# EAGLE design USB-6002-breakout-AIO (EAGLE 9.3.0)
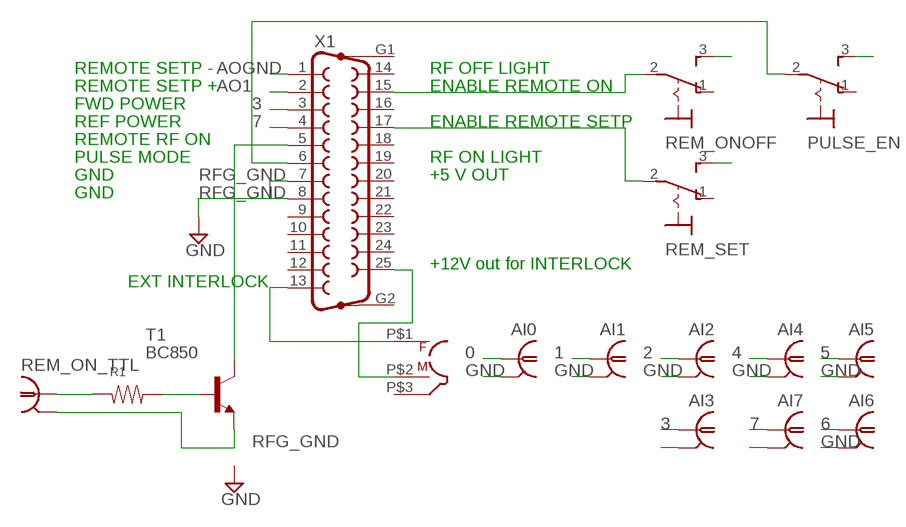
[diagram p0: schematic, sheet 1]

## Parts
AI0  BNC-V  [BNC-V]
AI1  BNC-V  [BNC-V]
AI2  BNC-V  [BNC-V]
AI3  BNC-V  [BNC-V]
AI4  BNC-V  [BNC-V]
AI5  BNC-V  [BNC-V]
AI6  BNC-V  [BNC-V]
AI7  BNC-V  [BNC-V]
INTERLOCK  TWINAX  [TWINAX-V]
PULSE_EN  M9040P  [M9040P]
R1  RES1206  [1206]
REM_ON_TTL  BNC-V  [BNC-V]
REM_ONOFF  M9040P  [M9040P]
REM_SET  M9040P  [M9040P]
T1  BC850  [SOT23]
X1  F25VP  [F25VP]

## Nets
0: AI0.1
1: AI1.1
2: AI2.1
3: AI3.1 X1.3
4: AI4.1
5: AI5.1
6: AI6.1
7: AI7.1 X1.4
AO1: X1.2
AOGND: X1.1
GND: AI0.2 AI1.2 AI2.2 AI3.2 AI4.2 AI5.2 AI6.2 AI7.2
N$1: REM_ONOFF.2(P) X1.15
N$2: REM_SET.2(P) X1.17
N$3: T1.3(C) X1.5
N$4: R1.1 REM_ON_TTL.1
N$5: R1.2 T1.1(B)
N$6: PULSE_EN.2(P) X1.6
N$7: INTERLOCK.P$1 X1.13
N$8: INTERLOCK.P$2 X1.25
RFG_GND: PULSE_EN.3(S) REM_ON_TTL.2 REM_ONOFF.3(S) REM_SET.3(S) T1.2(E) X1.7 X1.8 ; supply symbol labelled GND
Unconnected: INTERLOCK.P$3 PULSE_EN.1(O) REM_ONOFF.1(O) REM_SET.1(O) X1.9 X1.10 X1.11 X1.12 X1.14 X1.16 X1.18 X1.19 X1.20 X1.21 X1.22 X1.23 X1.24 X1.G1 X1.G2

## Notes on the sheet
- REMOTE SETP - | RF OFF LIGHT
- REMOTE SETP + | ENABLE REMOTE ON
- FWD POWER
- REF POWER | ENABLE REMOTE SETP
- REMOTE RF ON
- PULSE MODE | RF ON LIGHT
- GND | +5 V OUT
- GND
- +12V out for INTERLOCK
- EXT INTERLOCK

## Library data of the parts
AI0 AI1-AI7 REM_ON_TTL = connector-jqi:BNC: BNC Connector.
INTERLOCK = connector-jqi:TWINAX
PULSE_EN REM_ONOFF REM_SET = switch:M9040P: TOGGLE SWITCH Marquardt
R1 = rlc-jqi:RES: SMT Resistor
T1 = transistor:BC850: NPN TRANSISTOR
X1 = con-subd:F25VP: SUB-D; OC_FARNELL: unknown; OC_NEWARK: unknown

## Board
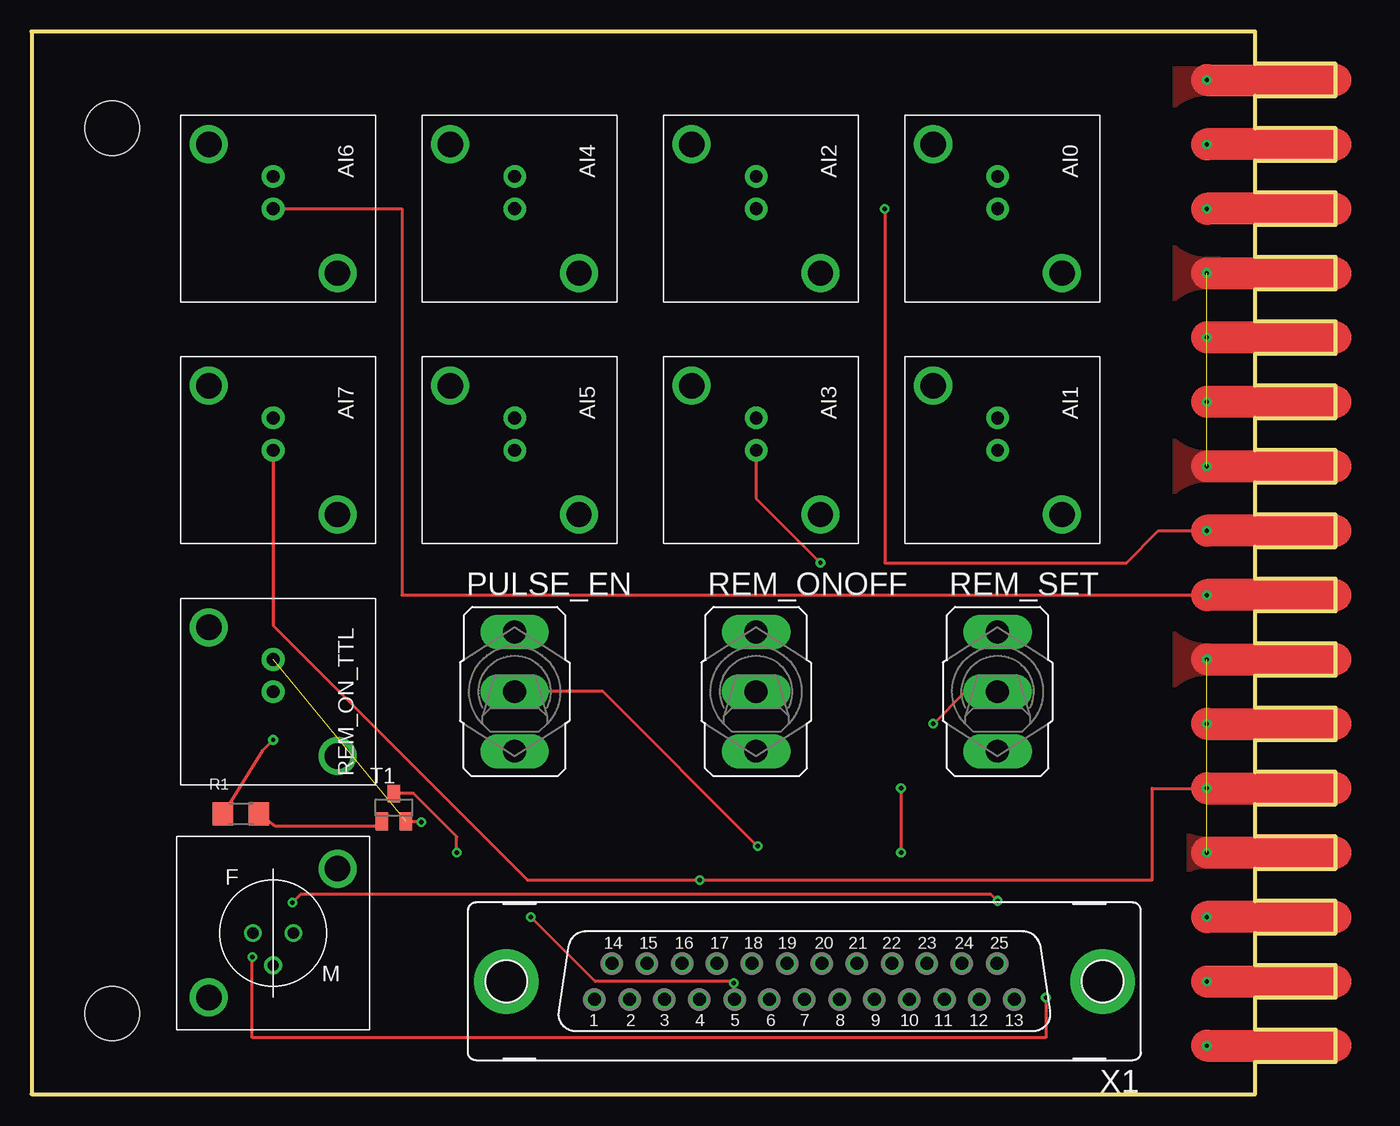
[diagram p1: board, top side]
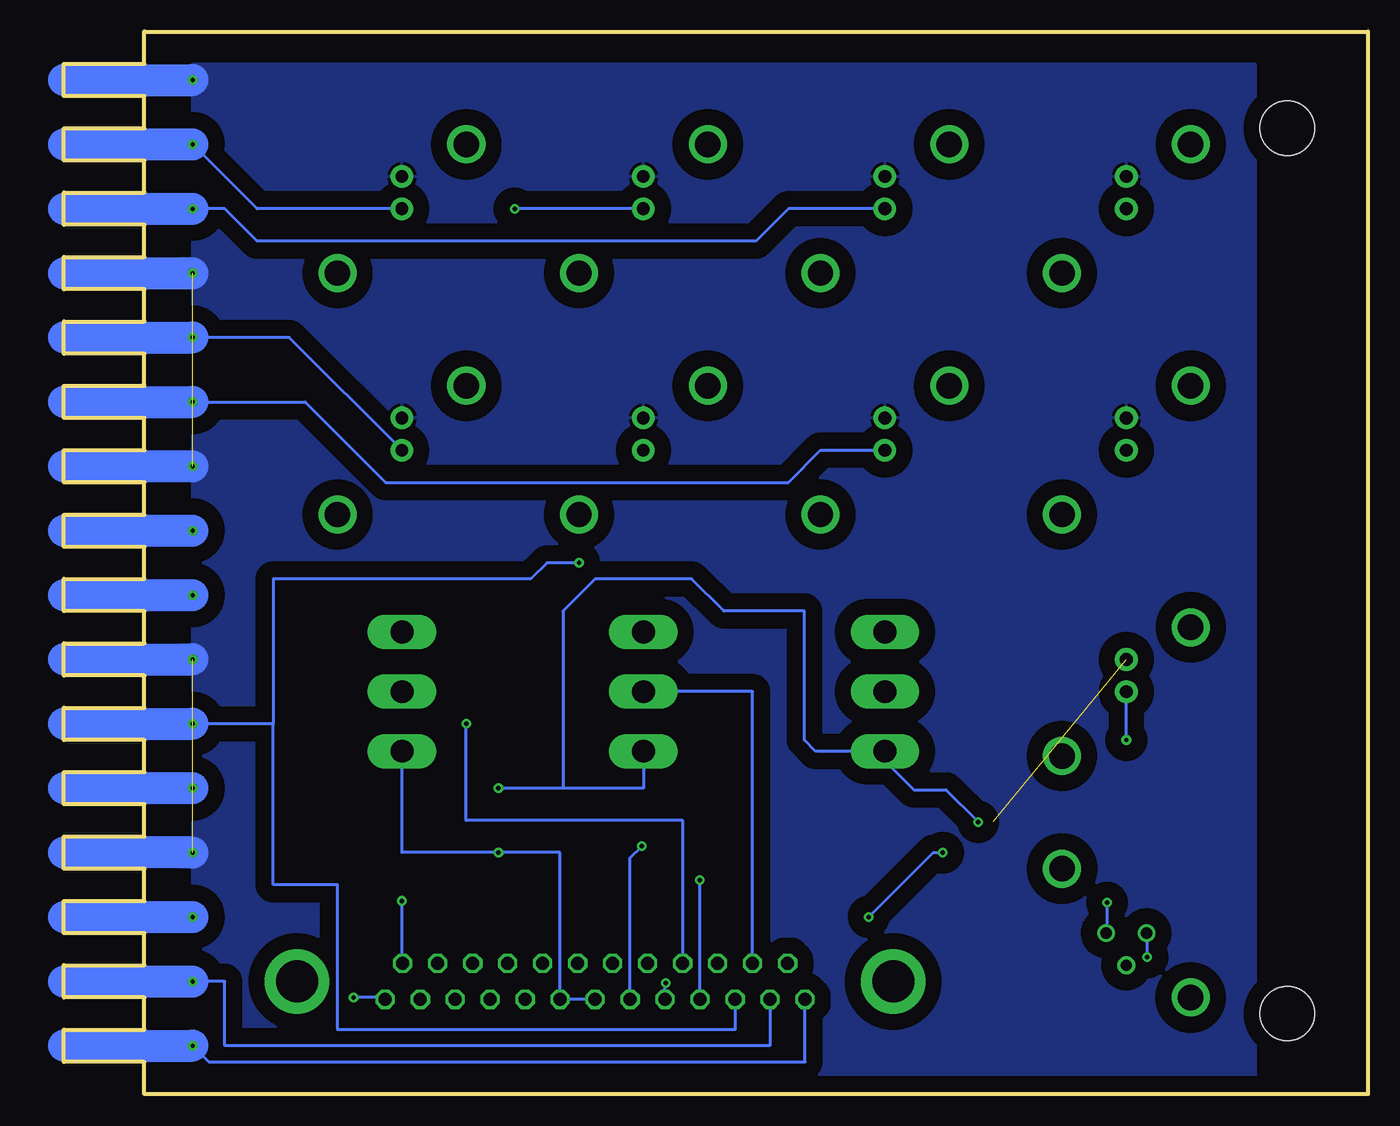
[diagram p2: board, bottom side, seen from below]

Size 102.87 x 83.82 mm. Coordinates in mm from the lower left corner, seen from the top.
Outline: 96.52,83.82 0,83.82 0,0 96.52,0 96.52,2.54 102.87,2.54 102.87,5.08 96.52,5.08 96.52,7.62 102.87,7.62 102.87,10.16 96.52,10.16 96.52,12.7 102.87,12.7 102.87,15.24 96.52,15.24 96.52,17.78 102.87,17.78 102.87,20.32 96.52,20.32 96.52,22.86 102.87,22.86 102.87,25.4 96.52,25.4 96.52,27.94 102.87,27.94 102.87,30.48 96.52,30.48 96.52,33.02 102.87,33.02 102.87,35.56 96.52,35.56 96.52,38.1 102.87,38.1 102.87,40.64 96.52,40.64 96.52,43.18 102.87,43.18 102.87,45.72 96.52,45.72 96.52,48.26 102.87,48.26 102.87,50.8 96.52,50.8 96.52,53.34 102.87,53.34 102.87,55.88 96.52,55.88 96.52,58.42 102.87,58.42 102.87,60.96 96.52,60.96 96.52,63.5 102.87,63.5 102.87,66.04 96.52,66.04 96.52,68.58 102.87,68.58 102.87,71.12 96.52,71.12 96.52,73.66 102.87,73.66 102.87,76.2 96.52,76.2 96.52,78.74 102.87,78.74 102.87,81.28 96.52,81.28 96.52,83.82
Copper layers (1*16): Top 0.035mm / dielectric 1.5mm / Bottom 0.035mm
Design rules "default": minimum track width 6mil, minimum drill 0.35mm, track to track 6mil, track to pad 6mil, pad to pad 6mil, via to via 6mil, smd to smd 6mil, copper to edge 40mil, drill to drill 6mil, minimum pad ring 10mil, minimum via ring 8mil, stop-mask expansion 4mil, vias tented up to drill 0mil, thermal gap 10mil
Holes 4.31 mm at 6.35,6.35 6.35,76.2

### Footprints (pad centres in the part's own frame; a part is rotated, then mirrored left to right if it is on the bottom)
BNC-V = drill 1 pad 1.778: 1 0,0; 2 -2.54,0 | drill 2 pad 2.032: ANCHOR1 -5.08,-5.08; ANCHOR2 5.08,5.08
TWINAX-V = drill 0.889: P$1 -1.6,0; P$2 1.6,0; P$3 0,-2.54 | drill 2.007: P$4 5.08,5.08; P$5 -5.08,-5.08
M9040P = drill 1.803 long: 1 0,4.699; 2 0,0; 3 0,-4.699
1206 = smd 1.6 x 1.803: 1 -1.422,0; 2 1.422,0
SOT23 = smd 1 x 1.4: 1 -0.95,-1.1; 2 0.95,-1.1; 3 0,1.1
F25VP = drill 1.016 octagon: 1 16.561,1.422; 2 13.792,1.422; 3 11.049,1.422; 4 8.28,1.422; 5 5.512,1.422; 6 2.769,1.422; 7 0,1.422; 8 -2.769,1.422; 9 -5.512,1.422; 10 -8.28,1.422; 11 -11.049,1.422; 12 -13.792,1.422; 13 -16.561,1.422; 14 15.189,-1.422; 15 12.421,-1.422; 16 9.652,-1.422; 17 6.909,-1.422; 18 4.14,-1.422; 19 1.372,-1.422; 20 -1.372,-1.422; 21 -4.14,-1.422; 22 -6.909,-1.422; 23 -9.652,-1.422; 24 -12.421,-1.422; 25 -15.189,-1.422 | drill 3.302 pad 5.08: G1 -23.52,0; G2 23.52,0

### Placement (x,y rotation side)
AI0  76.2,69.85 270 top
AI1  76.2,50.8 270 top
AI2  57.15,69.85 270 top
AI3  57.15,50.8 270 top
AI4  38.1,69.85 270 top
AI5  38.1,50.8 270 top
AI6  19.05,69.85 270 top
AI7  19.05,50.8 270 top
INTERLOCK  19.05,12.7 0 top
PULSE_EN  38.1,31.75 0 top
R1  16.51,22.1 0 top
REM_ON_TTL  19.05,31.75 270 top
REM_ONOFF  57.15,31.75 0 top
REM_SET  76.2,31.75 0 top
T1  28.57,22.61 0 top
X1  60.96,8.89 180 top

### Tracks (layer width: path | path; a pad name or v marks a point on that pad's centre or on a via)
0  (via drill 0.35)
  Top 2.54: 102.87,74.93 v92.71,74.93
  Bottom 0.254: AI0.1 87.63,69.85 v92.71,74.93
  Bottom 2.54: 102.87,74.93 v92.71,74.93
1  (via drill 0.35)
  Top 2.54: 102.87,59.69 v92.71,59.69
  Bottom 0.254: AI1.1 85.09,59.69 v92.71,59.69
  Bottom 2.54: 102.87,59.69 v92.71,59.69
2  (via drill 0.35)
  Top 0.254: v67.31,69.85 67.31,41.91 86.36,41.91 88.9,44.45 v92.71,44.45
  Top 2.54: 102.87,44.45 v92.71,44.45
  Bottom 0.254: AI2.1 v67.31,69.85
  Bottom 2.54: 102.87,44.45 v92.71,44.45
3  (via drill 0.35)
  Top 0.254: AI3.1 57.15,46.99 v62.23,41.91
  Top 2.54: v92.71,29.21 102.87,29.21
  Bottom 0.254: X1.3 49.91,5.08 81.28,5.08 81.28,16.51 86.36,16.51 86.36,29.21 | 86.36,29.21 v92.71,29.21 | v62.23,41.91 64.77,41.91 66.04,40.64 86.36,40.64 86.36,29.21
  Bottom 2.54: 102.87,29.21 v92.71,29.21
4  (via drill 0.35)
  Top 2.54: 102.87,69.85 v92.71,69.85
  Bottom 0.254: AI4.1 45.72,69.85 48.26,67.31 87.63,67.31 90.17,69.85 v92.71,69.85
  Bottom 2.54: 102.87,69.85 v92.71,69.85
5  (via drill 0.35)
  Top 2.54: 102.87,54.61 v92.71,54.61
  Bottom 0.254: v92.71,54.61 83.82,54.61 77.47,48.26 45.72,48.26 43.18,50.8 AI5.1
  Bottom 2.54: 102.87,54.61 v92.71,54.61
6  (via drill 0.35)
  Top 0.254: AI6.1 29.21,69.85 29.21,39.37 v92.71,39.37
  Top 2.54: 102.87,39.37 v92.71,39.37
  Bottom 2.54: 102.87,39.37 v92.71,39.37
7  (via drill 0.35)
  Top 0.254: v92.71,24.13 88.39,24.13 88.39,16.89 v52.7,16.89 39.12,16.89 19.05,36.96 AI7.1
  Top 2.54: v92.71,24.13 102.87,24.13
  Bottom 0.254: X1.4 52.68,16.89 v52.7,16.89
  Bottom 2.54: v92.71,24.13 102.87,24.13
AO0  (via drill 0.35)
  Top 2.54: 102.87,13.97 v92.71,13.97
  Bottom 2.54: 102.87,13.97 v92.71,13.97
AO1  (via drill 0.35)
  Top 2.54: v92.71,8.89 102.87,8.89
  Bottom 0.254: X1.2 47.17,3.81 90.17,3.81 90.17,8.89 v92.71,8.89
  Bottom 2.54: 102.87,8.89 v92.71,8.89
AOGND  (via drill 0.35)
  Top 2.54: v92.71,3.81 102.87,3.81
  Bottom 0.254: v92.71,3.81 91.44,2.54 44.4,2.54 X1.1
  Bottom 2.54: 102.87,3.81 v92.71,3.81
GND  (via drill 0.35)  (2 unrouted)
  Top 2.54: v92.71,80.01 102.87,80.01 | v92.71,64.77 102.87,64.77 | v92.71,49.53 102.87,49.53 | v92.71,34.29 102.87,34.29 | v92.71,19.05 102.87,19.05
  Bottom 2.54: 102.87,80.01 v92.71,80.01 | 102.87,64.77 v92.71,64.77 | 102.87,49.53 v92.71,49.53 | 102.87,34.29 v92.71,34.29 | v92.71,19.05 102.87,19.05
  pour Top (isolate 2.54): 96.52,82.55 96.52,1.27 90.17,1.27 90.17,82.55
  pour Bottom (isolate 2.54): 95.25,82.55 90.17,82.55 90.17,1.27 95.25,1.27
  pour Bottom (isolate 1.27): 92.71,81.28 8.89,81.28 8.89,1.27 92.71,1.27
N$1
  Bottom 0.254: X1.15 48.54,31.75 REM_ONOFF.2
N$2  (via drill 0.35)
  Top 0.254: REM_SET.2 73.66,31.75 v71.12,29.21
  Bottom 0.254: X1.17 54.05,21.59 71.12,21.59 v71.12,29.21
N$3  (via drill 0.35)
  Top 0.254: v55.37,8.76 55.37,8.89 44.45,8.89 v39.37,13.97 | v33.53,19.05 33.53,20.32 30.14,23.71 T1.3
  Bottom 0.254: X1.5 55.45,8.76 v55.37,8.76 | v39.37,13.97 34.29,19.05 v33.53,19.05
N$4  (via drill 0.35)
  Top 0.254: v19.05,27.94 18.21,27.1 R1.1
  Bottom 0.254: v19.05,27.94 REM_ON_TTL.1
N$5
  Top 0.254: T1.1 27.24,21.12 19.21,21.12 R1.2
N$6  (via drill 0.35)
  Top 0.254: v57.28,19.56 45.09,31.75 PULSE_EN.2
  Bottom 0.254: X1.6 58.19,18.64 v57.28,19.56
N$7  (via drill 0.35)
  Top 0.254: v80.01,7.62 80.01,4.45 17.4,4.45 v17.4,10.79
  Bottom 0.254: X1.13 77.67,7.62 v80.01,7.62 | v17.4,10.79 17.4,12.7 INTERLOCK.P$1
N$8  (via drill 0.35)
  Top 0.254: v76.2,15.24 75.69,15.75 21.21,15.75 v20.57,15.11
  Bottom 0.254: X1.25 76.2,10.36 v76.2,15.24 | v20.57,15.11 20.57,12.7 INTERLOCK.P$2
RFG_GND  (via drill 0.35)  (1 unrouted)
  Top 0.254: v68.58,24.13 v68.58,19.05 | v30.73,21.46 30.69,21.51 T1.2
  Bottom 0.254: REM_SET.3 76.2,19.05 v68.58,19.05 63.73,19.05 X1.8 X1.7 | REM_ONOFF.3 57.15,24.13 63.5,24.13 | 63.5,24.13 v68.58,24.13 | 63.5,24.13 63.5,38.1 60.96,40.64 53.34,40.64 50.8,38.1 44.45,38.1 44.45,27.94 43.56,27.05 PULSE_EN.3 38.1,26.29 35.81,24 33.27,24 v30.73,21.46